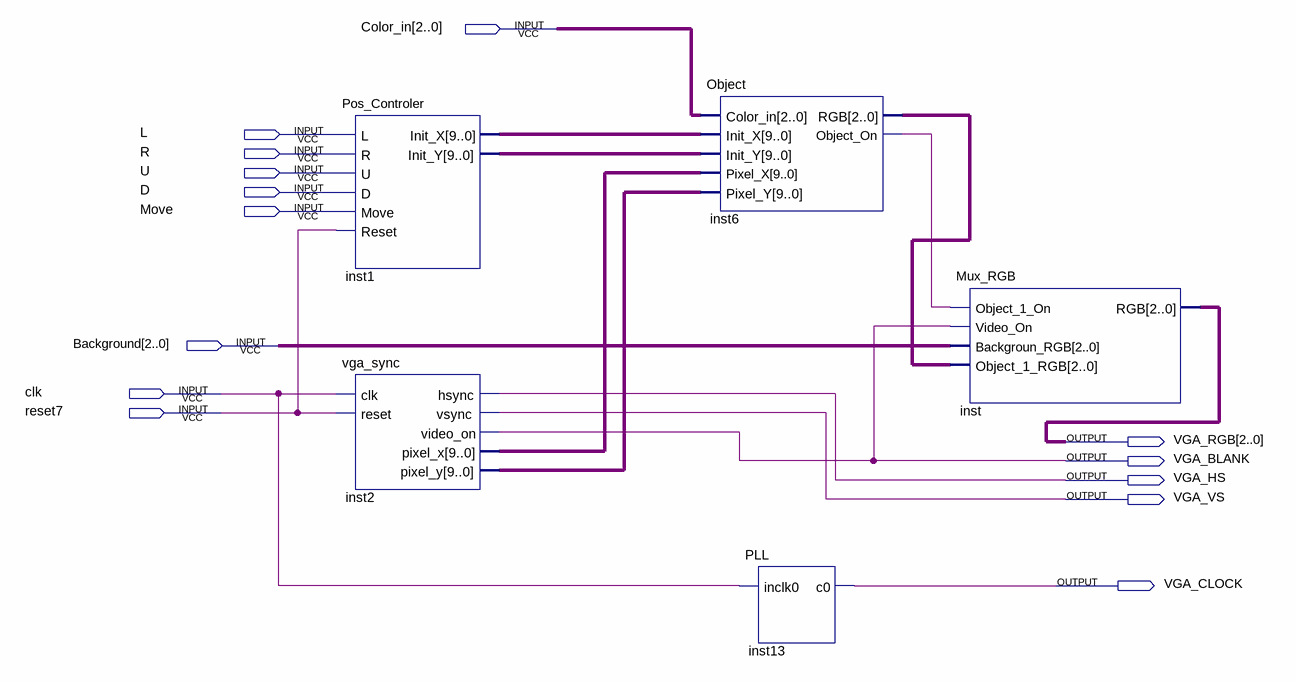
[diagram p0: schematic sheet]
// Quartus schematic VGA.bdf as structural Verilog: 5 symbols, 14 pins
module VGA (
  input  [2:0] Color_in,
  input  L,
  input  R,
  input  U,
  input  D,
  input  Move,
  input  [2:0] Background,
  input  clk,
  input  reset7,
  output [2:0] VGA_RGB,
  output VGA_BLANK,
  output VGA_HS,
  output VGA_VS,
  output VGA_CLOCK
);

  wire inst6_object_on;
  wire [2:0] inst6_rgb;
  wire [9:0] inst1_init_x, inst1_init_y, inst2_pixel_x, inst2_pixel_y;

  Pos_Controler inst1 (
    .L(L), .R(R), .U(U), .D(D), .Move(Move), .Reset(reset7), .Init_X(inst1_init_x), .Init_Y(inst1_init_y));
  vga_sync inst2 (
    .clk(clk), .reset(reset7), .hsync(VGA_HS), .vsync(VGA_VS), .video_on(VGA_BLANK), .pixel_x(inst2_pixel_x),
    .pixel_y(inst2_pixel_y));
  Object inst6 (
    .Color_in(Color_in), .Init_X(inst1_init_x), .Init_Y(inst1_init_y), .Pixel_X(inst2_pixel_x),
    .Pixel_Y(inst2_pixel_y), .RGB(inst6_rgb), .Object_On(inst6_object_on));
  PLL inst13 (.inclk0(clk), .c0(VGA_CLOCK));
  Mux_RGB inst (
    .Object_1_On(inst6_object_on), .Video_On(VGA_BLANK), .Backgroun_RGB(Background),
    .Object_1_RGB(inst6_rgb), .RGB(VGA_RGB));
endmodule
